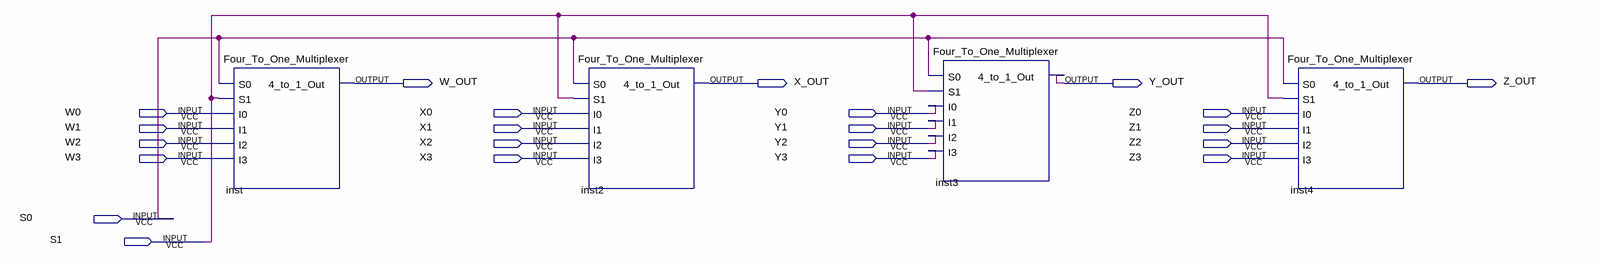
[diagram p0: schematic sheet]
// Quartus schematic Quad_Four_To_One_Multiplexer.bdf as structural Verilog: 4 symbols, 22 pins
module Quad_Four_To_One_Multiplexer (
  input  W0,
  input  X0,
  input  Y0,
  input  Z0,
  input  W1,
  input  X1,
  input  Y1,
  input  Z1,
  input  W2,
  input  X2,
  input  Y2,
  input  Z2,
  input  W3,
  input  X3,
  input  Y3,
  input  Z3,
  input  S0,
  input  S1,
  output W_OUT,
  output X_OUT,
  output Y_OUT,
  output Z_OUT
);

  Four_To_One_Multiplexer inst (.S0(S0), .S1(S1), .I0(W0), .I1(W1), .I2(W2), .I3(W3), .\4_to_1_Out (W_OUT));
  Four_To_One_Multiplexer inst2 (.S0(S0), .S1(S1), .I0(X0), .I1(X1), .I2(X2), .I3(X3), .\4_to_1_Out (X_OUT));
  Four_To_One_Multiplexer inst3 (.S0(S0), .S1(S1), .I0(Y0), .I1(Y1), .I2(Y2), .I3(Y3), .\4_to_1_Out (Y_OUT));
  Four_To_One_Multiplexer inst4 (.S0(S0), .S1(S1), .I0(Z0), .I1(Z1), .I2(Z2), .I3(Z3), .\4_to_1_Out (Z_OUT));
endmodule
